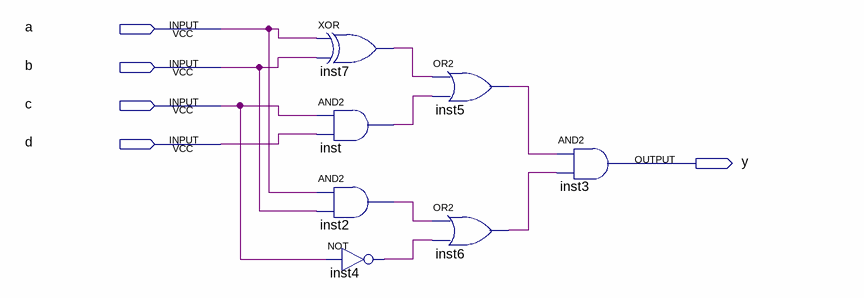
[diagram p0: schematic sheet]
// Quartus schematic top.bdf as structural Verilog: 7 symbols, 5 pins
module top (
  input  a,
  input  b,
  input  c,
  input  d,
  output y
);

  wire inst2_out, inst4_out, inst5_out, inst6_out, inst7_out, inst_out;

  xor inst7 (inst7_out, a, b);
  and inst (inst_out, c, d);
  and inst2 (inst2_out, a, b);
  not inst4 (inst4_out, c);
  or inst5 (inst5_out, inst7_out, inst_out);
  or inst6 (inst6_out, inst2_out, inst4_out);
  and inst3 (y, inst5_out, inst6_out);
endmodule
